# Altium project Digital_Input_Card_V1_1.PrjPcb
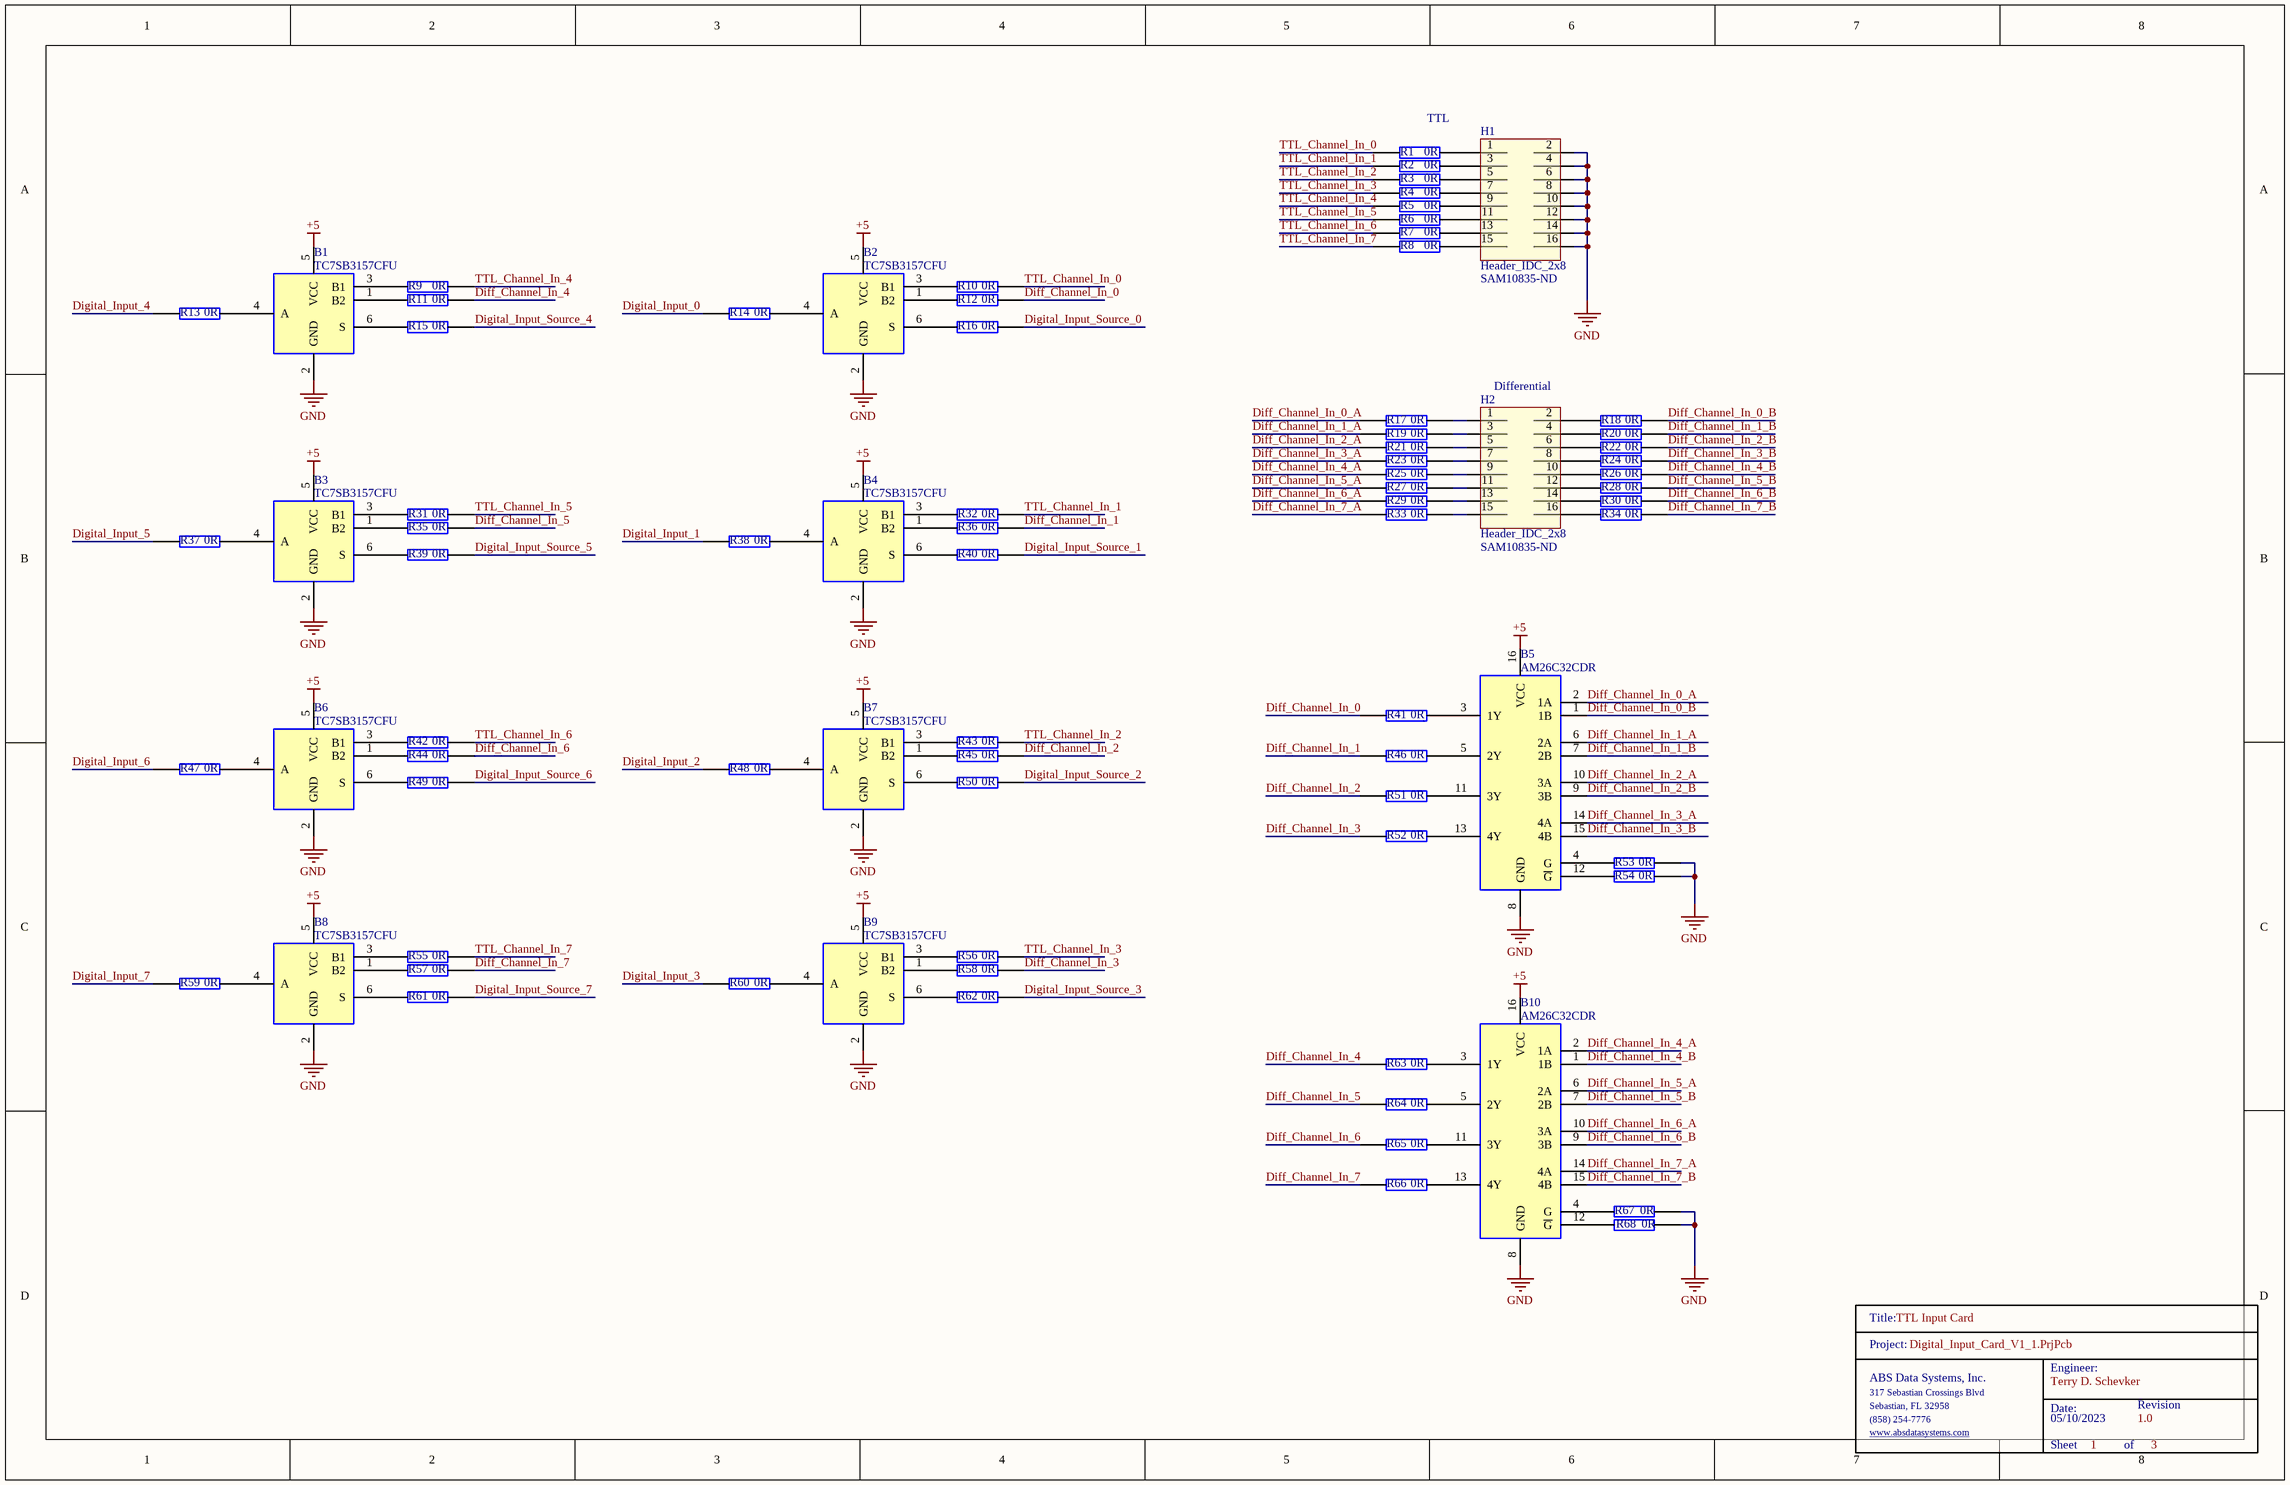
[diagram p0: Digital_Input.SchDoc]
3 sheets, 263 parts. Net scope: global (net labels, ports and power ports of the same name join across sheets).
Board file: Digital_Input_PCB.PcbDoc
Sheets:
  Digital_Input.SchDoc
  Digital_Input_CPU.SchDoc
  Digital_Input_LED_Monitor.SchDoc

## Sheet Digital_Input.SchDoc: TTL Input Card
size Tabloid; Date: 05/10/2023; Engineer: Terry D. Schevker; Revision: 1.0; SheetNumber: 1; SheetTotal: 3

### Parts
B1  TC7SB3157CFU  [SOT-363-6]
B2  TC7SB3157CFU  [SOT-363-6]
B3  TC7SB3157CFU  [SOT-363-6]
B4  TC7SB3157CFU  [SOT-363-6]
B5  AM26C32CDR  [SOIC127P600X175-16N]
B6  TC7SB3157CFU  [SOT-363-6]
B7  TC7SB3157CFU  [SOT-363-6]
B8  TC7SB3157CFU  [SOT-363-6]
B9  TC7SB3157CFU  [SOT-363-6]
B10  AM26C32CDR  [SOIC127P600X175-16N]
H1  Header_IDC_2x8  Supplier Part Number 1: SAM10835-ND  [HDR2X8]
H2  Header_IDC_2x8  Supplier Part Number 1: SAM10835-ND  [HDR2X8]
R1  0R  [0603]
R2  0R  [0603]
R3  0R  [0603]
R4  0R  [0603]
R5  0R  [0603]
R6  0R  [0603]
R7  0R  [0603]
R8  0R  [0603]
R9  0R  [0603]
R10  0R  [0603]
R11  0R  [0603]
R12  0R  [0603]
R13  0R  [0603]
R14  0R  [0603]
R15  0R  [0603]
R16  0R  [0603]
R17  0R  [0603]
R18  0R  [0603]
R19  0R  [0603]
R20  0R  [0603]
R21  0R  [0603]
R22  0R  [0603]
R23  0R  [0603]
R24  0R  [0603]
R25  0R  [0603]
R26  0R  [0603]
R27  0R  [0603]
R28  0R  [0603]
R29  0R  [0603]
R30  0R  [0603]
R31  0R  [0603]
R32  0R  [0603]
R33  0R  [0603]
R34  0R  [0603]
R35  0R  [0603]
R36  0R  [0603]
R37  0R  [0603]
R38  0R  [0603]
R39  0R  [0603]
R40  0R  [0603]
R41  0R  [0603]
R42  0R  [0603]
R43  0R  [0603]
R44  0R  [0603]
R45  0R  [0603]
R46  0R  [0603]
R47  0R  [0603]
R48  0R  [0603]
R49  0R  [0603]
R50  0R  [0603]
R51  0R  [0603]
R52  0R  [0603]
R53  0R  [0603]
R54  0R  [0603]
R55  0R  [0603]
R56  0R  [0603]
R57  0R  [0603]
R58  0R  [0603]
R59  0R  [0603]
R60  0R  [0603]
R61  0R  [0603]
R62  0R  [0603]
R63  0R  [0603]
R64  0R  [0603]
R65  0R  [0603]
R66  0R  [0603]
R67  0R  [0603]
R68  0R  [0603]
TitleBlock_4  TitleBlock  (value not drawn)  (graphical)

### Nets
+5: B1.5(VCC) B2.5(VCC) B3.5(VCC) B4.5(VCC) B5.16(VCC) B6.5(VCC) B7.5(VCC) B8.5(VCC) B9.5(VCC) B10.16(VCC)
GND: B1.2(GND) B2.2(GND) B3.2(GND) B4.2(GND) B5.8(GND) B6.2(GND) B7.2(GND) B8.2(GND) B9.2(GND) B10.8(GND) H1.2 H1.4 H1.6 H1.8 H1.10 H1.12 H1.14 H1.16 R53.2 R54.2 R67.2 R68.2
Diff_Channel_In_0: R12.2 R41.1
Diff_Channel_In_0_A: B5.2(1A) R17.1
Diff_Channel_In_0_B: B5.1(1B) R18.2
Diff_Channel_In_1: R36.2 R46.1
Diff_Channel_In_1_A: B5.6(2A) R19.1
Diff_Channel_In_1_B: B5.7(2B) R20.2
Diff_Channel_In_2: R45.2 R51.1
Diff_Channel_In_2_A: B5.10(3A) R21.1
Diff_Channel_In_2_B: B5.9(3B) R22.2
Diff_Channel_In_3: R52.1 R58.2
Diff_Channel_In_3_A: B5.14(4A) R23.1
Diff_Channel_In_3_B: B5.15(4B) R24.2
Diff_Channel_In_4: R11.2 R63.1
Diff_Channel_In_4_A: B10.2(1A) R25.1
Diff_Channel_In_4_B: B10.1(1B) R26.2
Diff_Channel_In_5: R35.2 R64.1
Diff_Channel_In_5_A: B10.6(2A) R27.1
Diff_Channel_In_5_B: B10.7(2B) R28.2
Diff_Channel_In_6: R44.2 R65.1
Diff_Channel_In_6_A: B10.10(3A) R29.1
Diff_Channel_In_6_B: B10.9(3B) R30.2
Diff_Channel_In_7: R57.2 R66.1
Diff_Channel_In_7_A: B10.14(4A) R33.1
Diff_Channel_In_7_B: B10.15(4B) R34.2
Digital_Input_0: R14.1
Digital_Input_1: R38.1
Digital_Input_2: R48.1
Digital_Input_3: R60.1
Digital_Input_4: R13.1
Digital_Input_5: R37.1
Digital_Input_6: R47.1
Digital_Input_7: R59.1
Digital_Input_Source_0: R16.2
Digital_Input_Source_1: R40.2
Digital_Input_Source_2: R50.2
Digital_Input_Source_3: R62.2
Digital_Input_Source_4: R15.2
Digital_Input_Source_5: R39.2
Digital_Input_Source_6: R49.2
Digital_Input_Source_7: R61.2
TTL_Channel_In_0: R1.1 R10.2
TTL_Channel_In_1: R2.1 R32.2
TTL_Channel_In_2: R3.1 R43.2
TTL_Channel_In_3: R4.1 R56.2
TTL_Channel_In_4: R5.1 R9.2
TTL_Channel_In_5: R6.1 R31.2
TTL_Channel_In_6: R7.1 R42.2
TTL_Channel_In_7: R8.1 R55.2
NetB1_1: B1.1(B2) R11.1
NetB1_3: B1.3(B1) R9.1
NetB1_4: B1.4(A) R13.2
NetB1_6: B1.6(S) R15.1
NetB2_1: B2.1(B2) R12.1
NetB2_3: B2.3(B1) R10.1
NetB2_4: B2.4(A) R14.2
NetB2_6: B2.6(S) R16.1
NetB3_1: B3.1(B2) R35.1
NetB3_3: B3.3(B1) R31.1
NetB3_4: B3.4(A) R37.2
NetB3_6: B3.6(S) R39.1
NetB4_1: B4.1(B2) R36.1
NetB4_3: B4.3(B1) R32.1
NetB4_4: B4.4(A) R38.2
NetB4_6: B4.6(S) R40.1
NetB5_3: B5.3(1Y) R41.2
NetB5_4: B5.4(G) R53.1
NetB5_5: B5.5(2Y) R46.2
NetB5_11: B5.11(3Y) R51.2
NetB5_12: B5.12(~{G}) R54.1
NetB5_13: B5.13(4Y) R52.2
NetB6_1: B6.1(B2) R44.1
NetB6_3: B6.3(B1) R42.1
NetB6_4: B6.4(A) R47.2
NetB6_6: B6.6(S) R49.1
NetB7_1: B7.1(B2) R45.1
NetB7_3: B7.3(B1) R43.1
NetB7_4: B7.4(A) R48.2
NetB7_6: B7.6(S) R50.1
NetB8_1: B8.1(B2) R57.1
NetB8_3: B8.3(B1) R55.1
NetB8_4: B8.4(A) R59.2
NetB8_6: B8.6(S) R61.1
NetB9_1: B9.1(B2) R58.1
NetB9_3: B9.3(B1) R56.1
NetB9_4: B9.4(A) R60.2
NetB9_6: B9.6(S) R62.1
NetB10_3: B10.3(1Y) R63.2
NetB10_4: B10.4(G) R67.1
NetB10_5: B10.5(2Y) R64.2
NetB10_11: B10.11(3Y) R65.2
NetB10_12: B10.12(~{G}) R68.1
NetB10_13: B10.13(4Y) R66.2
NetH1_1: H1.1 R1.2
NetH1_3: H1.3 R2.2
NetH1_5: H1.5 R3.2
NetH1_7: H1.7 R4.2
NetH1_9: H1.9 R5.2
NetH1_11: H1.11 R6.2
NetH1_13: H1.13 R7.2
NetH1_15: H1.15 R8.2
NetH2_1: H2.1 R17.2
NetH2_2: H2.2 R18.1
NetH2_3: H2.3 R19.2
NetH2_4: H2.4 R20.1
NetH2_5: H2.5 R21.2
NetH2_6: H2.6 R22.1
NetH2_7: H2.7 R23.2
NetH2_8: H2.8 R24.1
NetH2_9: H2.9 R25.2
NetH2_10: H2.10 R26.1
NetH2_11: H2.11 R27.2
NetH2_12: H2.12 R28.1
NetH2_13: H2.13 R29.2
NetH2_14: H2.14 R30.1
NetH2_15: H2.15 R33.2
NetH2_16: H2.16 R34.1

### Notes on the sheet
- TTL
- Differential
- (in symbol TitleBlock) Title:; Project:; Engineer:; ABS Data Systems, Inc.; 317 Sebastian Crossings Blvd; Sebastian, FL 32958; Date:; Revision; (858) 254-7776; www.absdatasystems.com; Sheet; of

### Library data of the parts
B1-B4 B6-B9 = TC7SB3157CFU: TC7SB3157CFU MUX 2 in 1 out with control bit; Manufacturer_Name: Nexperia; Manufacturer_Part_Number: PMP3906AYSH; Geometry.Height: 1.1mm; Mouser Part Number: 771-PMP3906AYSH; Mouser Price/Stock: https://www.mouser.co.uk/ProductDetail/Nexperia/PMP3906AYSH?qs=vvQtp7zwQdPhl6IciBiaKA%3D%3D; Datasheet Link: https://assets.nexperia.com/documents/data-sheet/PMP3906AYS.pdf
B5 B10 = AM26C32CDR: TEXAS INSTRUMENTS - AM26C32CDR - Receiver RS422/423, 4 Drivers, 4.5V-5.5V supply, SOIC-16; Geometry.Height: 1.75mm; Mouser Part Number: 595-AM26C32CDR; Mouser Price/Stock: https://www.mouser.co.uk/ProductDetail/Texas-Instruments/AM26C32CDR?qs=LgZHeZZt5MVmFjCK4imaTA%3D%3D; Manufacturer_Name: Texas Instruments; Manufacturer_Part_Number: AM26C32CDR; Datasheet Link: https://www.ti.com/lit/ds/symlink/am26c32.pdf?ts=1601403310434&ref_url=https%253A%252F%252Fwww.ti.com%252Fproduct%252FAM26C32
H1 H2 = Header_IDC_2x8: 16 Pin 2x8 Through Hold IDC Connector; Manufacturer: Samtec; Manufacturer Part Number: TST-108-01-G-D; Number of Contacts: 16; Gender: Male; Connector Type: Male Pin; Pitch: 2.54mm; Row Spacing: 0.1inch; Supplier 1: Digi-Key; RoHS: Yes; Category: Headers and Wire Housings; Stock 1: 227; Pricing 1: 1=2.85000, 10=2.73600, 100=2.28000, 500=1.93800, 1000=1.65300, 5000=1.48200 (USD); Mount: Through Hole; Contact Plating: Gold; Contact Material: Bronze; Housing Material: Polyester; Housing Color: Black; Color: Black; Min Operating Temperature: -55°C; Max Operating Temperature: 125°C; Number of Rows: 2; Termination: Solder; Packaging: Rail/Tube; Orientation: Straight; Number of Positions: 16; Length: 27.94mm; Depth: 9.27mm; Contact Mating Length: 0.25inch; REACH SVHC: No SVHC; ComponentLink1URL: https://datasheet.ciiva.com/739/tst-mkt-739845.pdf?src-supplier=Digi-Key; ComponentLink1Description: https://datasheet.ciiva.com/739/tst-mkt-739845.pdf?src-supplier=Digi-Key; ComponentLink2URL: https://datasheet.ciiva.com/10018/htst-10018510.pdf?src-supplier=Avnet; ComponentLink2Description: https://datasheet.ciiva.com/10018/htst-10018510.pdf?src-supplier=Avnet
R1-R68 = RC0603JR-070RL: YAGEO 0603 0 ohm; Manufacturer_Name: KEMET; Geometry.Height: 0.55mm; Mouser Part Number: 603-RC0603JR-070RL; Mouser Price/Stock: https://www.mouser.co.uk/ProductDetail/YAGEO/RC0603JR-070RL?qs=2cAdsCoAWRGWyPcuXgGiXQ%3D%3D; Manufacturer_Part_Number: RC0603JR-070RL; Datasheet Link: https://datasheet.datasheetarchive.com/originals/distributors/Datasheets_SAMA/902f9e387b938f871d31120f5fc1d65e.pdf

## Sheet Digital_Input_CPU.SchDoc: TTL IO Interface for External I/O
size Tabloid; Date: 03/13/2023; Engineer: Terry D. Schevker; Revision: 1,0; SheetNumber: 2; SheetTotal: 3
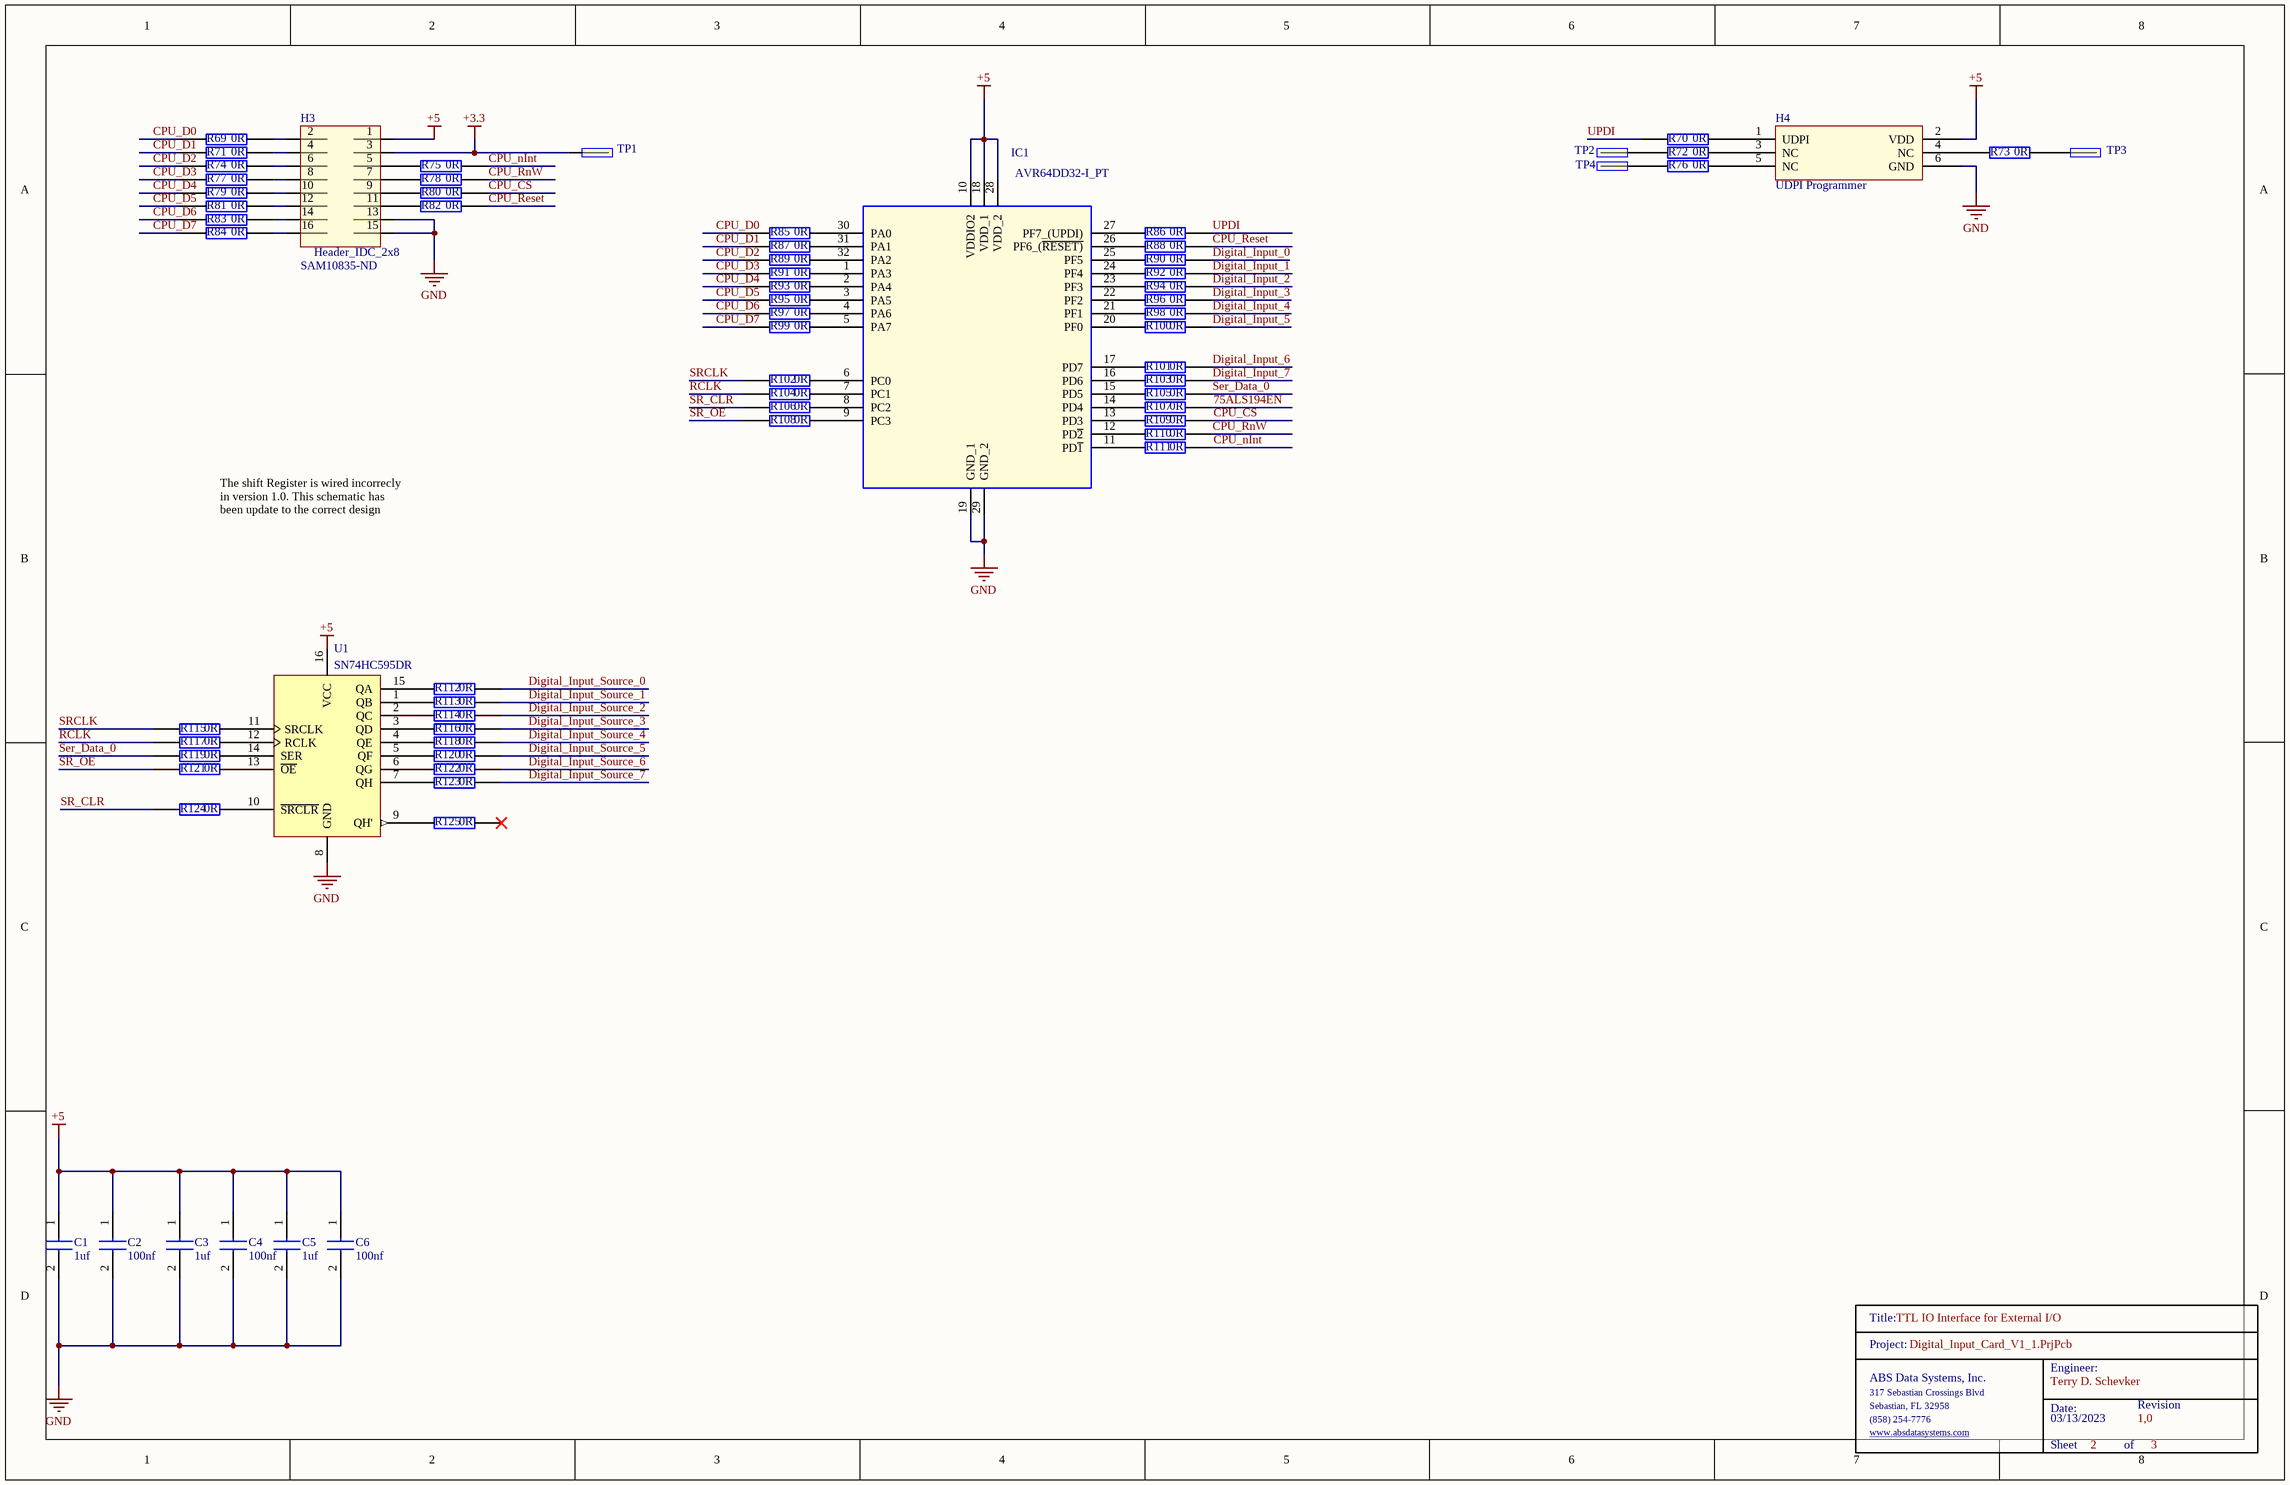
[diagram p1: Digital_Input_CPU.SchDoc]

### Parts
C1  1uf  [0603]
C2  100nf  [0603]
C3  1uf  [0603]
C4  100nf  [0603]
C5  1uf  [0603]
C6  100nf  [0603]
H3  Header_IDC_2x8  Supplier Part Number 1: SAM10835-ND  [HEADER16]
H4  UDPI Programmer  [HDR2X3]
IC1  AVR64DD32-I_PT  [QFP80P900X900X120-32N]
R69  0R  [0603]
R70  0R  [0603]
R71  0R  [0603]
R72  0R  [0603]
R73  0R  [0603]
R74  0R  [0603]
R75  0R  [0603]
R76  0R  [0603]
R77  0R  [0603]
R78  0R  [0603]
R79  0R  [0603]
R80  0R  [0603]
R81  0R  [0603]
R82  0R  [0603]
R83  0R  [0603]
R84  0R  [0603]
R85  0R  [0603]
R86  0R  [0603]
R87  0R  [0603]
R88  0R  [0603]
R89  0R  [0603]
R90  0R  [0603]
R91  0R  [0603]
R92  0R  [0603]
R93  0R  [0603]
R94  0R  [0603]
R95  0R  [0603]
R96  0R  [0603]
R97  0R  [0603]
R98  0R  [0603]
R99  0R  [0603]
R100  0R  [0603]
R101  0R  [0603]
R102  0R  [0603]
R103  0R  [0603]
R104  0R  [0603]
R105  0R  [0603]
R106  0R  [0603]
R107  0R  [0603]
R108  0R  [0603]
R109  0R  [0603]
R110  0R  [0603]
R111  0R  [0603]
R112  0R  [0603]
R113  0R  [0603]
R114  0R  [0603]
R115  0R  [0603]
R116  0R  [0603]
R117  0R  [0603]
R118  0R  [0603]
R119  0R  [0603]
R120  0R  [0603]
R121  0R  [0603]
R122  0R  [0603]
R123  0R  [0603]
R124  0R  [0603]
R125  0R  [0603]
TitleBlock_1  TitleBlock  (value not drawn)  (graphical)
TP1  TP  [TP]  (value not drawn)
TP2  TP  [TP]  (value not drawn)
TP3  TP  [TP]  (value not drawn)
TP4  TP  [TP]  (value not drawn)
U1  SN74HC595DR  [SOIC_16_Narrow]

### Nets
+3.3: H3.3 TP1.1
+5: C1.1 C2.1 C3.1 C4.1 C5.1 C6.1 H3.1 H4.2(VDD) IC1.10(VDDIO2) IC1.18(VDD_1) IC1.28(VDD_2) U1.16(VCC)
GND: C1.2 C2.2 C3.2 C4.2 C5.2 C6.2 H3.13 H3.15 H4.6(GND) IC1.19(GND_1) IC1.29(GND_2) U1.8(GND)
75ALS194EN: R107.2
CPU_CS: R80.2 R109.2
CPU_D0: R69.1 R85.1
CPU_D1: R71.1 R87.1
CPU_D2: R74.1 R89.1
CPU_D3: R77.1 R91.1
CPU_D4: R79.1 R93.1
CPU_D5: R81.1 R95.1
CPU_D6: R83.1 R97.1
CPU_D7: R84.1 R99.1
CPU_nInt: R75.2 R111.2
CPU_Reset: R82.2 R88.2
CPU_RnW: R78.2 R110.2
Digital_Input_0: R90.2
Digital_Input_1: R92.2
Digital_Input_2: R94.2
Digital_Input_3: R96.2
Digital_Input_4: R98.2
Digital_Input_5: R100.2
Digital_Input_6: R101.2
Digital_Input_7: R103.2
Digital_Input_Source_0: R112.2
Digital_Input_Source_1: R113.2
Digital_Input_Source_2: R114.2
Digital_Input_Source_3: R116.2
Digital_Input_Source_4: R118.2
Digital_Input_Source_5: R120.2
Digital_Input_Source_6: R122.2
Digital_Input_Source_7: R123.2
RCLK: R104.1 R117.1
Ser_Data_0: R105.2 R119.1
SR_CLR: R106.1 R124.1
SR_OE: R108.1 R121.1
SRCLK: R102.1 R115.1
UPDI: R70.1 R86.2
NetH3_2: H3.2 R69.2
NetH3_4: H3.4 R71.2
NetH3_5: H3.5 R75.1
NetH3_6: H3.6 R74.2
NetH3_7: H3.7 R78.1
NetH3_8: H3.8 R77.2
NetH3_9: H3.9 R80.1
NetH3_10: H3.10 R79.2
NetH3_11: H3.11 R82.1
NetH3_12: H3.12 R81.2
NetH3_14: H3.14 R83.2
NetH3_16: H3.16 R84.2
NetH4_1: H4.1(UDPI) R70.2
NetH4_3: H4.3(NC) R72.2
NetH4_4: H4.4(NC) R73.1
NetH4_5: H4.5(NC) R76.2
NetIC1_1: IC1.1(PA3) R91.2
NetIC1_2: IC1.2(PA4) R93.2
NetIC1_3: IC1.3(PA5) R95.2
NetIC1_4: IC1.4(PA6) R97.2
NetIC1_5: IC1.5(PA7) R99.2
NetIC1_6: IC1.6(PC0) R102.2
NetIC1_7: IC1.7(PC1) R104.2
NetIC1_8: IC1.8(PC2) R106.2
NetIC1_9: IC1.9(PC3) R108.2
NetIC1_11: IC1.11(PD~{1}) R111.1
NetIC1_12: IC1.12(PD~{2}) R110.1
NetIC1_13: IC1.13(PD3) R109.1
NetIC1_14: IC1.14(PD4) R107.1
NetIC1_15: IC1.15(PD5) R105.1
NetIC1_16: IC1.16(PD6) R103.1
NetIC1_17: IC1.17(PD7) R101.1
NetIC1_20: IC1.20(PF0) R100.1
NetIC1_21: IC1.21(PF1) R98.1
NetIC1_22: IC1.22(PF2) R96.1
NetIC1_23: IC1.23(PF3) R94.1
NetIC1_24: IC1.24(PF4) R92.1
NetIC1_25: IC1.25(PF5) R90.1
NetIC1_26: IC1.26(PF6_(~{RESET)}) R88.1
NetIC1_27: IC1.27(PF7_(UPDI)) R86.1
NetIC1_30: IC1.30(PA0) R85.2
NetIC1_31: IC1.31(PA1) R87.2
NetIC1_32: IC1.32(PA2) R89.2
NetR72_1: R72.1 TP2.1
NetR73_2: R73.2 TP3.1
NetR76_1: R76.1 TP4.1
NetR112_1: R112.1 U1.15(QA)
NetR113_1: R113.1 U1.1(QB)
NetR114_1: R114.1 U1.2(QC)
NetR115_2: R115.2 U1.11(SRCLK)
NetR116_1: R116.1 U1.3(QD)
NetR117_2: R117.2 U1.12(RCLK)
NetR118_1: R118.1 U1.4(QE)
NetR119_2: R119.2 U1.14(SER)
NetR120_1: R120.1 U1.5(QF)
NetR121_2: R121.2 U1.13(~{OE})
NetR122_1: R122.1 U1.6(QG)
NetR123_1: R123.1 U1.7(QH)
NetR124_2: R124.2 U1.10(~{SRCLR})
NetR125_1: R125.1 U1.9(QH')

Not connected (* = marked no-connect by the designer): R125 2*

### Notes on the sheet
- The shift Register is wired incorrecly in version 1.0. This schematic has been update to the correct design
- (in symbol TitleBlock) Title:; Project:; Engineer:; ABS Data Systems, Inc.; 317 Sebastian Crossings Blvd; Sebastian, FL 32958; Date:; Revision; (858) 254-7776; www.absdatasystems.com; Sheet; of

### Library data of the parts
C1 C3 C5 = CL10B105KA8NNNL: Samsung Electro-Mechanics 0603 1uf
C2 C4 C6 = CL10B104JB8NNNC: Samsung Electro-Mechanics 0603 100nf
H3 = Header_IDC_2x8: as H1 on sheet Digital_Input; Supplier 1: Digi-Key; RoHS: Yes; Category: Headers and Wire Housings; Stock 1: 227; Pricing 1: 1=2.85000, 10=2.73600, 100=2.28000, 500=1.93800, 1000=1.65300, 5000=1.48200 (USD); Mount: Through Hole; Contact Plating: Gold; Contact Material: Bronze; Housing Material: Polyester; Housing Color: Black; Color: Black; Min Operating Temperature: -55°C; Max Operating Temperature: 125°C; Number of Rows: 2; Termination: Solder; Packaging: Rail/Tube; Orientation: Straight; Number of Positions: 16; Length: 27.94mm; Depth: 9.27mm; Contact Mating Length: 0.25inch; REACH SVHC: No SVHC; ComponentLink1URL: https://datasheet.ciiva.com/739/tst-mkt-739845.pdf?src-supplier=Digi-Key; ComponentLink1Description: https://datasheet.ciiva.com/739/tst-mkt-739845.pdf?src-supplier=Digi-Key; ComponentLink2URL: https://datasheet.ciiva.com/10018/htst-10018510.pdf?src-supplier=Avnet; ComponentLink2Description: https://datasheet.ciiva.com/10018/htst-10018510.pdf?src-supplier=Avnet
H4 = UDPI Programmer: 6 Pin 2X3 Through Hole Header
IC1 = AVR64DD32-I_PT: Integrated Circuit; Manufacturer_Name: Microchip; Manufacturer_Part_Number: AVR64DD32-I/PT | MULTI-VOLTAGE I/O; Datasheet Link: https://www.microchip.com/en-us/product/AVR64DD32; Height: 1.2mm
R69-R125 = RC0603JR-070RL: as R1 on sheet Digital_Input; Mouser Part Number: 603-RC0603JR-070RL; Mouser Price/Stock: https://www.mouser.co.uk/ProductDetail/YAGEO/RC0603JR-070RL?qs=2cAdsCoAWRGWyPcuXgGiXQ%3D%3D; Manufacturer_Part_Number: RC0603JR-070RL; Datasheet Link: https://datasheet.datasheetarchive.com/originals/distributors/Datasheets_SAMA/902f9e387b938f871d31120f5fc1d65e.pdf
TP1-TP4 = TP: Manufacturer: Samtec; Manufacturer Part Number: TST-105-01-G-D; Number of Contacts: 16; Gender: Male; Connector Type: Male Pin; Pitch: 2.54mm; Row Spacing: 0.1inch; Supplier 1: Digi-Key; RoHS: Yes; Category: Headers and Wire Housings; Stock 1: 227; Pricing 1: 1=2.85000, 10=2.73600, 100=2.28000, 500=1.93800, 1000=1.65300, 5000=1.48200 (USD); Mount: Through Hole; Contact Plating: Gold; Contact Material: Bronze; Housing Material: Polyester; Housing Color: Black; Color: Black; Min Operating Temperature: -55°C; Max Operating Temperature: 125°C; Number of Rows: 2; Termination: Solder; Packaging: Rail/Tube; Orientation: Straight; Number of Positions: 16; Length: 27.94mm; Depth: 9.27mm; Contact Mating Length: 0.25inch; REACH SVHC: No SVHC; ComponentLink1URL: https://datasheet.ciiva.com/739/tst-mkt-739845.pdf?src-supplier=Digi-Key; ComponentLink1Description: https://datasheet.ciiva.com/739/tst-mkt-739845.pdf?src-supplier=Digi-Key; ComponentLink2URL: https://datasheet.ciiva.com/10018/htst-10018510.pdf?src-supplier=Avnet; ComponentLink2Description: https://datasheet.ciiva.com/10018/htst-10018510.pdf?src-supplier=Avnet
U1 = SN74HC595DR: 8-Bit Shift Registers With 3-State Output Registers, D0016A, LARGE T&R; Manufacturer: Texas Instruments; Output Drive (IOL/IOH)(Max)(mA): 7.8/-7.8; Rating: Military; ICC @ Nom Voltage(Max)(mA): 0.08; VCC(Min)(V): 2; tpd @ Nom Voltage(Max)(ns): 34; 3-State Output: Yes; Output Type: CMOS; Voltage(Nom)(V): 6; F @ Nom Voltage(Max)(Mhz): 28; Technology Family: HC; Bits: 4; Max Supply Voltage: 6V; Min Supply Voltage: 2V; Propagation Delay: 250ns; Number of Elements: 1; Number of Output Lines: 10; Direction: Unidirectional; Number of Bits: 8; Quiescent Current: 8uA; Operating Supply Voltage: 5V; Frequency: 42MHz; Max Input Current: 1uA; PackageReference: D0016A; Code_JEDEC: MS-012 variation AC; Generic Part Number: SN74HC595; Operating Temperature Range(C): -40 to 85; DatasheetVersion: SCLS041H; PackageVersion: http://www.ti.com/lit/ml/mpds178g/mpds178g.pdf; Input Type: CMOS; VCC(Max)(V): 6; Supplier 1: Digi-Key; Supplier Part Number 1: 296-14857-1-ND; Manufacturer Part Number: SN74HC595DR; Stock 1: 38406; Pricing 1: 1=0.51000, 10=0.43300, 100=0.32300, 500=0.25380, 1000=0.19611 (USD); RoHS: Yes; Mount: Surface Mount; Case/Package: SOIC; Number of Pins: 16; Weight: 0.004998oz; Contact Plating: Gold; Min Operating Temperature: -40°C; Max Operating Temperature: 85°C; Packaging: Tape and Reel; Package Quantity: 2500; Logic Function: Shift Register; Number of Circuits: 4; Number of Bits per Element: 8; Turn-On Delay Time: 250ns; Termination: SMD/SMT; Length: 9.9mm; Height: 1.58mm; Width: 3.91mm; Radiation Hardening: No; REACH SVHC: No SVHC; Lead Free: Lead Free; ComponentLink1URL: https://datasheet.ciiva.com/15093/getdatasheetpartid-134875-15093436.pdf?src-supplier=Verical; ComponentLink1Description: https://datasheet.ciiva.com/15093/getdatasheetpartid-134875-15093436.pdf?src-supplier=Verical; ComponentLink2URL: https://datasheet.ciiva.com/22696/1831198-22696812.pdf?src-supplier=Element14; ComponentLink2Description: https://datasheet.ciiva.com/22696/1831198-22696812.pdf?src-supplier=Element14; ComponentLink3URL: https://datasheet.ciiva.com/34301/916385-34301758.pdf?src-supplier=Jameco; ComponentLink3Description: https://datasheet.ciiva.com/34301/916385-34301758.pdf?src-supplier=Jameco; ComponentLink4URL: https://datasheet.ciiva.com/26866/sn74hc595dr-26866161.pdf?src-supplier=IIIC; ComponentLink4Description: https://datasheet.ciiva.com/26866/sn74hc595dr-26866161.pdf?src-supplier=IIIC; ComponentLink5URL: https://datasheet.ciiva.com/1886/sn74hc595-1886279.pdf?src-supplier=Digi-Key; ComponentLink5Description: https://datasheet.ciiva.com/1886/sn74hc595-1886279.pdf?src-supplier=Digi-Key; ComponentLink6URL: https://datasheet.ciiva.com/1886/sn74hc595-1886280.pdf?src-supplier=Digi-Key; ComponentLink6Description: https://datasheet.ciiva.com/1886/sn74hc595-1886280.pdf?src-supplier=Digi-Key; ComponentLink7URL: https://datasheet.ciiva.com/1886/sn74hc595-1886281.pdf?src-supplier=Digi-Key; ComponentLink7Description: https://datasheet.ciiva.com/1886/sn74hc595-1886281.pdf?src-supplier=Digi-Key; ComponentLink8URL: https://datasheet.ciiva.com/1509/1831198-1509483.pdf?src-supplier=Element14; ComponentLink8Description: https://datasheet.ciiva.com/1509/1831198-1509483.pdf?src-supplier=Element14; ComponentLink9URL: https://datasheet.ciiva.com/46381/1886142-46381835.pdf?src-supplier=Element14; ComponentLink9Description: https://datasheet.ciiva.com/46381/1886142-46381835.pdf?src-supplier=Element14; ComponentLink10URL: https://datasheet.ciiva.com/14294/sn74hc595-14294989.pdf?src-supplier=Avnet; ComponentLink10Description: https://datasheet.ciiva.com/14294/sn74hc595-14294989.pdf?src-supplier=Avnet; ComponentLink11URL: https://datasheet.ciiva.com/14294/sn74hc595-14294991.pdf?src-supplier=Avnet; ComponentLink11Description: https://datasheet.ciiva.com/14294/sn74hc595-14294991.pdf?src-supplier=Avnet; ComponentLink12URL: https://datasheet.ciiva.com/46435/1831198-46435871.pdf?src-supplier=Element14; ComponentLink12Description: https://datasheet.ciiva.com/46435/1831198-46435871.pdf?src-supplier=Element14

## Sheet Digital_Input_LED_Monitor.SchDoc: TTL IO LED Monitor
size Tabloid; Date: 05/10/2023; Engineer: Terry D. Schevker; Revision: 1.0; SheetNumber: 3; SheetTotal: 3
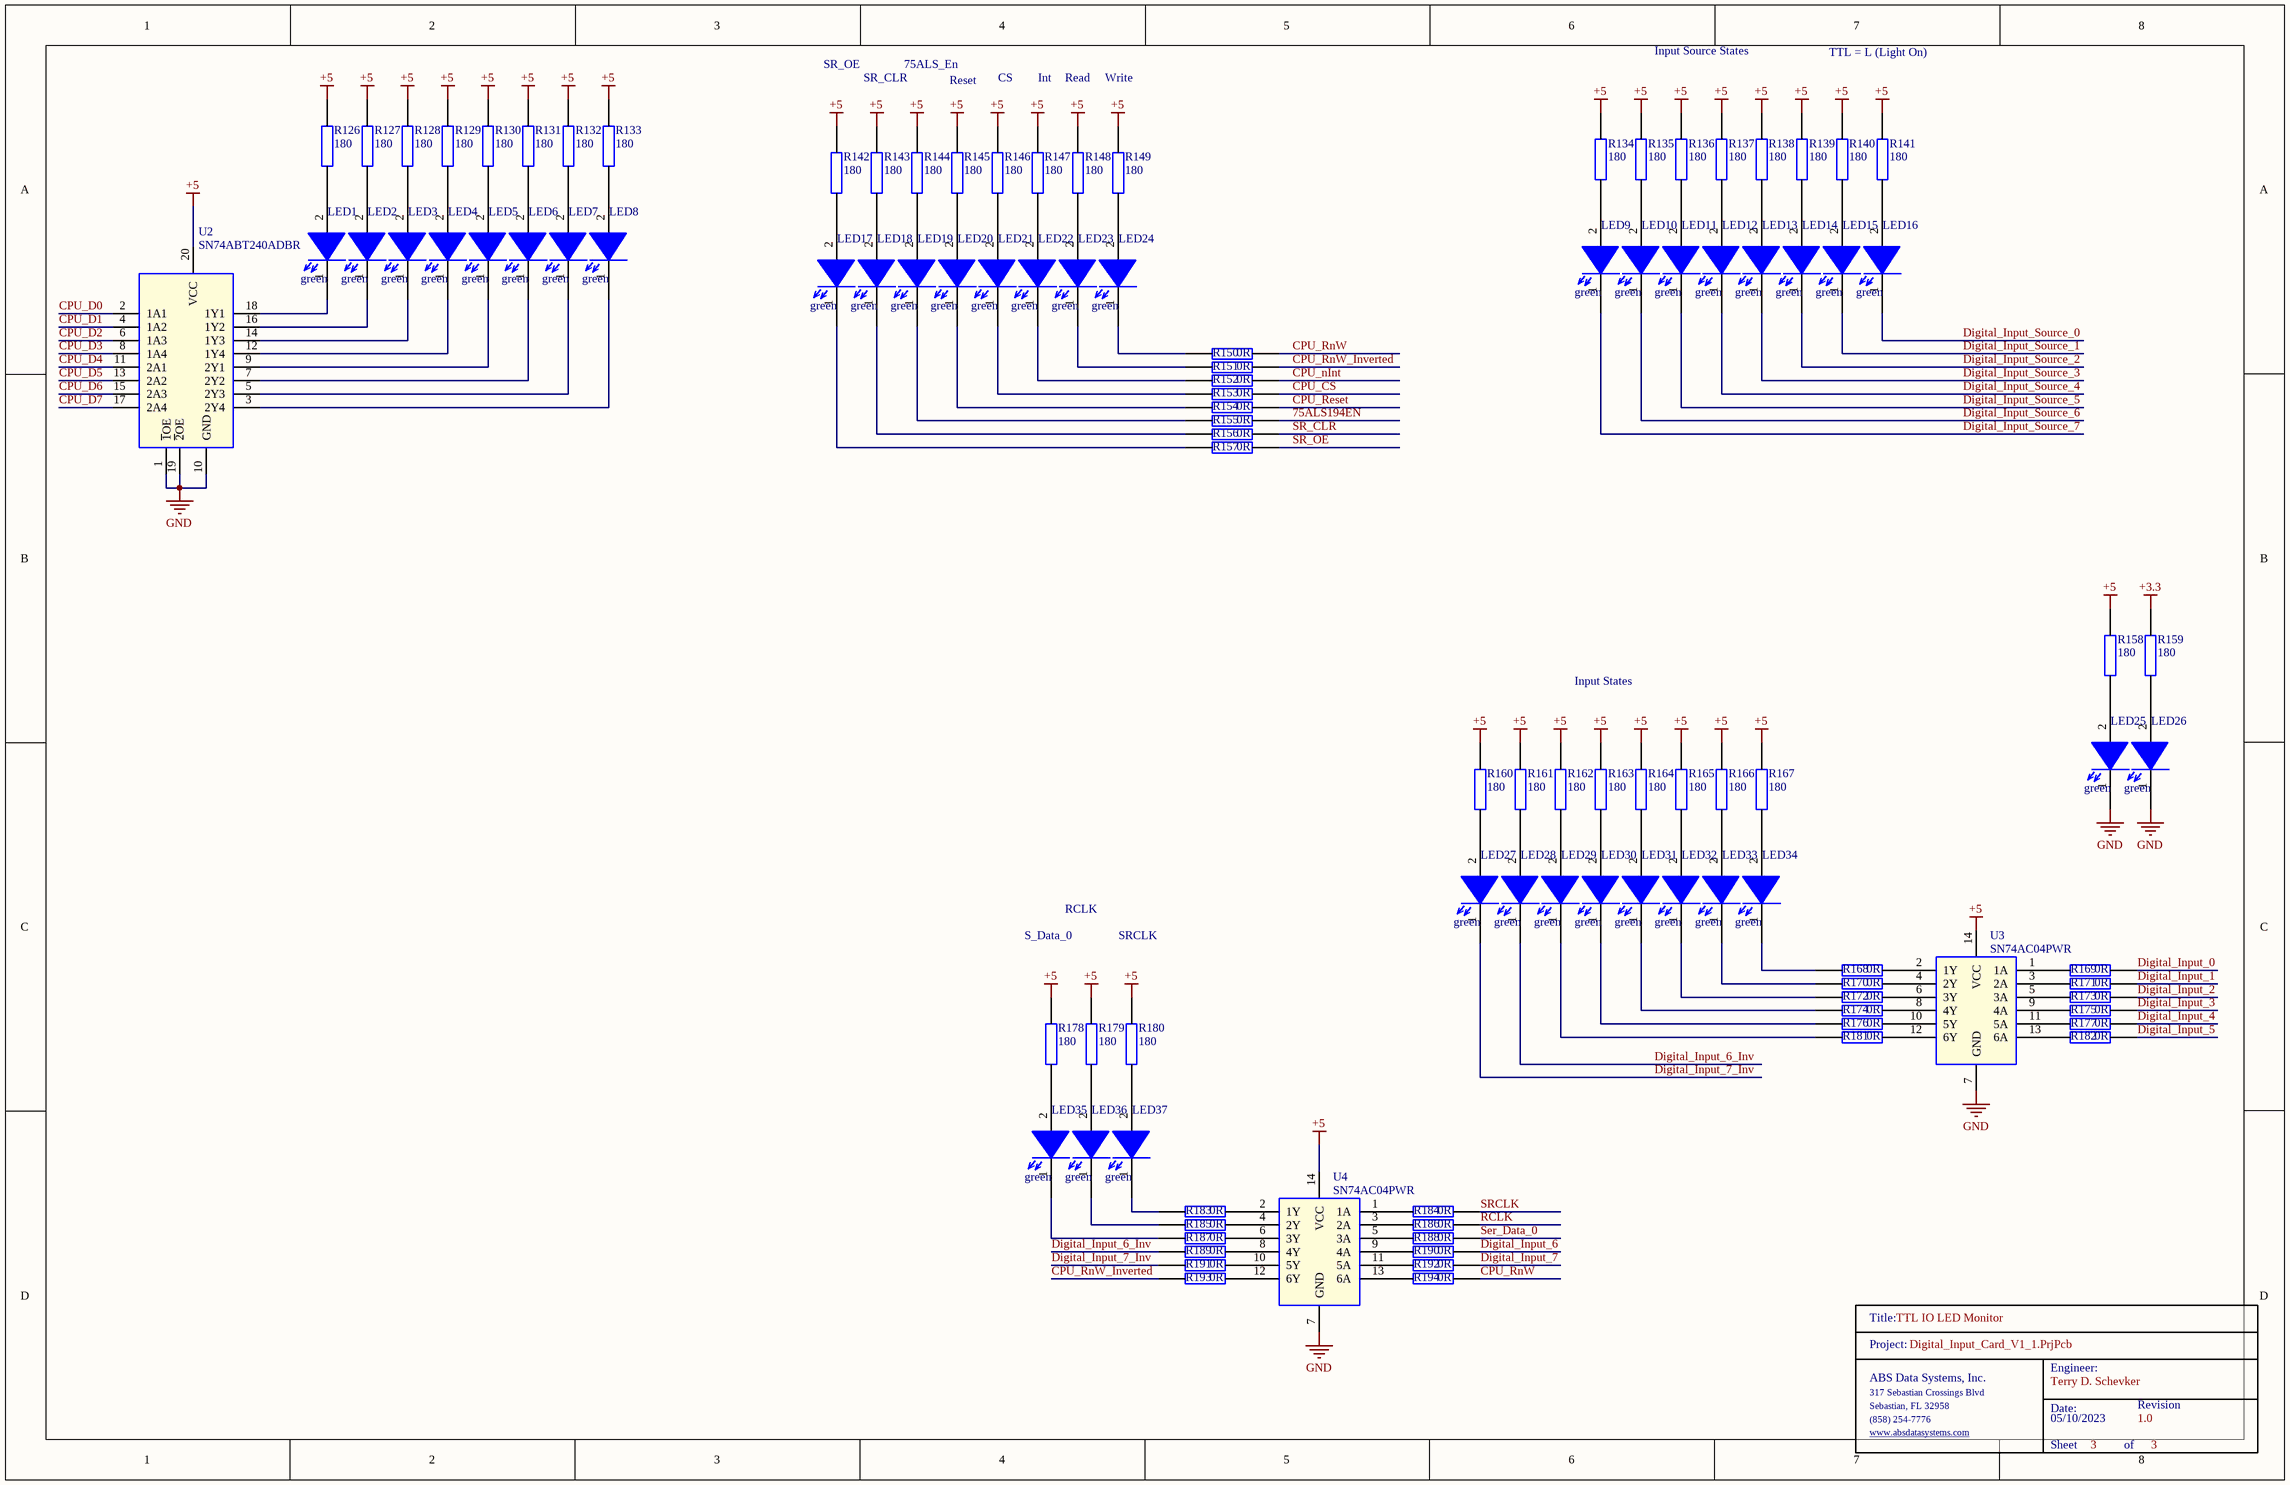
[diagram p2: Digital_Input_LED_Monitor.SchDoc]

### Parts
LED1  green  [0603_Diode]
LED2  green  [0603_Diode]
LED3  green  [0603_Diode]
LED4  green  [0603_Diode]
LED5  green  [0603_Diode]
LED6  green  [0603_Diode]
LED7  green  [0603_Diode]
LED8  green  [0603_Diode]
LED9  green  [0603_Diode]
LED10  green  [0603_Diode]
LED11  green  [0603_Diode]
LED12  green  [0603_Diode]
LED13  green  [0603_Diode]
LED14  green  [0603_Diode]
LED15  green  [0603_Diode]
LED16  green  [0603_Diode]
LED17  green  [0603_Diode]
LED18  green  [0603_Diode]
LED19  green  [0603_Diode]
LED20  green  [0603_Diode]
LED21  green  [0603_Diode]
LED22  green  [0603_Diode]
LED23  green  [0603_Diode]
LED24  green  [0603_Diode]
LED25  green  [0603_Diode]
LED26  green  [0603_Diode]
LED27  green  [0603_Diode]
LED28  green  [0603_Diode]
LED29  green  [0603_Diode]
LED30  green  [0603_Diode]
LED31  green  [0603_Diode]
LED32  green  [0603_Diode]
LED33  green  [0603_Diode]
LED34  green  [0603_Diode]
LED35  green  [0603_Diode]
LED36  green  [0603_Diode]
LED37  green  [0603_Diode]
R126  180  [0603]
R127  180  [0603]
R128  180  [0603]
R129  180  [0603]
R130  180  [0603]
R131  180  [0603]
R132  180  [0603]
R133  180  [0603]
R134  180  [0603]
R135  180  [0603]
R136  180  [0603]
R137  180  [0603]
R138  180  [0603]
R139  180  [0603]
R140  180  [0603]
R141  180  [0603]
R142  180  [0603]
R143  180  [0603]
R144  180  [0603]
R145  180  [0603]
R146  180  [0603]
R147  180  [0603]
R148  180  [0603]
R149  180  [0603]
R150  0R  [0603]
R151  0R  [0603]
R152  0R  [0603]
R153  0R  [0603]
R154  0R  [0603]
R155  0R  [0603]
R156  0R  [0603]
R157  0R  [0603]
R158  180  [0603]
R159  180  [0603]
R160  180  [0603]
R161  180  [0603]
R162  180  [0603]
R163  180  [0603]
R164  180  [0603]
R165  180  [0603]
R166  180  [0603]
R167  180  [0603]
R168  0R  [0603]
R169  0R  [0603]
R170  0R  [0603]
R171  0R  [0603]
R172  0R  [0603]
R173  0R  [0603]
R174  0R  [0603]
R175  0R  [0603]
R176  0R  [0603]
R177  0R  [0603]
R178  180  [0603]
R179  180  [0603]
R180  180  [0603]
R181  0R  [0603]
R182  0R  [0603]
R183  0R  [0603]
R184  0R  [0603]
R185  0R  [0603]
R186  0R  [0603]
R187  0R  [0603]
R188  0R  [0603]
R189  0R  [0603]
R190  0R  [0603]
R191  0R  [0603]
R192  0R  [0603]
R193  0R  [0603]
R194  0R  [0603]
TitleBlock_2  TitleBlock  (value not drawn)  (graphical)
U2  SN74ABT240ADBR  [SOP65P780X200-20N]
U3  SN74AC04PWR  [SOP65P640X120-14N]
U4  SN74AC04PWR  [SOP65P640X120-14N]

### Nets
+3.3: R159.2
+5: R126.2 R127.2 R128.2 R129.2 R130.2 R131.2 R132.2 R133.2 R134.2 R135.2 R136.2 R137.2 R138.2 R139.2 R140.2 R141.2 R142.2 R143.2 R144.2 R145.2 R146.2 R147.2 R148.2 R149.2 R158.2 R160.2 R161.2 R162.2 R163.2 R164.2 R165.2 R166.2 R167.2 R178.2 R179.2 R180.2 U2.20(VCC) U3.14(VCC) U4.14(VCC)
GND: LED25.1(K) LED26.1(K) U2.1(~{1}OE) U2.10(GND) U2.19(~{2}OE) U3.7(GND) U4.7(GND)
75ALS194EN: R155.2
CPU_CS: R153.2
CPU_D0: U2.2(1A1)
CPU_D1: U2.4(1A2)
CPU_D2: U2.6(1A3)
CPU_D3: U2.8(1A4)
CPU_D4: U2.11(2A1)
CPU_D5: U2.13(2A2)
CPU_D6: U2.15(2A3)
CPU_D7: U2.17(2A4)
CPU_nInt: R152.2
CPU_Reset: R154.2
CPU_RnW: R150.2 R194.2
CPU_RnW_Inverted: R151.2 R193.1
Digital_Input_0: R169.2
Digital_Input_1: R171.2
Digital_Input_2: R173.2
Digital_Input_3: R175.2
Digital_Input_4: R177.2
Digital_Input_5: R182.2
Digital_Input_6: R190.2
Digital_Input_6_Inv: LED28.1(K) R189.1
Digital_Input_7: R192.2
Digital_Input_7_Inv: LED27.1(K) R191.1
Digital_Input_Source_0: LED16.1(K)
Digital_Input_Source_1: LED15.1(K)
Digital_Input_Source_2: LED14.1(K)
Digital_Input_Source_3: LED13.1(K)
Digital_Input_Source_4: LED12.1(K)
Digital_Input_Source_5: LED11.1(K)
Digital_Input_Source_6: LED10.1(K)
Digital_Input_Source_7: LED9.1(K)
RCLK: R186.2
Ser_Data_0: R188.2
SR_CLR: R156.2
SR_OE: R157.2
SRCLK: R184.2
NetLED1_1: LED1.1(K) U2.18(1Y1)
NetLED1_2: LED1.2(A) R126.1
NetLED2_1: LED2.1(K) U2.16(1Y2)
NetLED2_2: LED2.2(A) R127.1
NetLED3_1: LED3.1(K) U2.14(1Y3)
NetLED3_2: LED3.2(A) R128.1
NetLED4_1: LED4.1(K) U2.12(1Y4)
NetLED4_2: LED4.2(A) R129.1
NetLED5_1: LED5.1(K) U2.9(2Y1)
NetLED5_2: LED5.2(A) R130.1
NetLED6_1: LED6.1(K) U2.7(2Y2)
NetLED6_2: LED6.2(A) R131.1
NetLED7_1: LED7.1(K) U2.5(2Y3)
NetLED7_2: LED7.2(A) R132.1
NetLED8_1: LED8.1(K) U2.3(2Y4)
NetLED8_2: LED8.2(A) R133.1
NetLED9_2: LED9.2(A) R134.1
NetLED10_2: LED10.2(A) R135.1
NetLED11_2: LED11.2(A) R136.1
NetLED12_2: LED12.2(A) R137.1
NetLED13_2: LED13.2(A) R138.1
NetLED14_2: LED14.2(A) R139.1
NetLED15_2: LED15.2(A) R140.1
NetLED16_2: LED16.2(A) R141.1
NetLED17_1: LED17.1(K) R157.1
NetLED17_2: LED17.2(A) R142.1
NetLED18_1: LED18.1(K) R156.1
NetLED18_2: LED18.2(A) R143.1
NetLED19_1: LED19.1(K) R155.1
NetLED19_2: LED19.2(A) R144.1
NetLED20_1: LED20.1(K) R154.1
NetLED20_2: LED20.2(A) R145.1
NetLED21_1: LED21.1(K) R153.1
NetLED21_2: LED21.2(A) R146.1
NetLED22_1: LED22.1(K) R152.1
NetLED22_2: LED22.2(A) R147.1
NetLED23_1: LED23.1(K) R151.1
NetLED23_2: LED23.2(A) R148.1
NetLED24_1: LED24.1(K) R150.1
NetLED24_2: LED24.2(A) R149.1
NetLED25_2: LED25.2(A) R158.1
NetLED26_2: LED26.2(A) R159.1
NetLED27_2: LED27.2(A) R160.1
NetLED28_2: LED28.2(A) R161.1
NetLED29_1: LED29.1(K) R181.1
NetLED29_2: LED29.2(A) R162.1
NetLED30_1: LED30.1(K) R176.1
NetLED30_2: LED30.2(A) R163.1
NetLED31_1: LED31.1(K) R174.1
NetLED31_2: LED31.2(A) R164.1
NetLED32_1: LED32.1(K) R172.1
NetLED32_2: LED32.2(A) R165.1
NetLED33_1: LED33.1(K) R170.1
NetLED33_2: LED33.2(A) R166.1
NetLED34_1: LED34.1(K) R168.1
NetLED34_2: LED34.2(A) R167.1
NetLED35_1: LED35.1(K) R187.1
NetLED35_2: LED35.2(A) R178.1
NetLED36_1: LED36.1(K) R185.1
NetLED36_2: LED36.2(A) R179.1
NetLED37_1: LED37.1(K) R183.1
NetLED37_2: LED37.2(A) R180.1
NetR168_2: R168.2 U3.2(1Y)
NetR169_1: R169.1 U3.1(1A)
NetR170_2: R170.2 U3.4(2Y)
NetR171_1: R171.1 U3.3(2A)
NetR172_2: R172.2 U3.6(3Y)
NetR173_1: R173.1 U3.5(3A)
NetR174_2: R174.2 U3.8(4Y)
NetR175_1: R175.1 U3.9(4A)
NetR176_2: R176.2 U3.10(5Y)
NetR177_1: R177.1 U3.11(5A)
NetR181_2: R181.2 U3.12(6Y)
NetR182_1: R182.1 U3.13(6A)
NetR183_2: R183.2 U4.2(1Y)
NetR184_1: R184.1 U4.1(1A)
NetR185_2: R185.2 U4.4(2Y)
NetR186_1: R186.1 U4.3(2A)
NetR187_2: R187.2 U4.6(3Y)
NetR188_1: R188.1 U4.5(3A)
NetR189_2: R189.2 U4.8(4Y)
NetR190_1: R190.1 U4.9(4A)
NetR191_2: R191.2 U4.10(5Y)
NetR192_1: R192.1 U4.11(5A)
NetR193_2: R193.2 U4.12(6Y)
NetR194_1: R194.1 U4.13(6A)

### Notes on the sheet
- SR_OE
- SR_CLR
- 75ALS_En
- Reset
- CS
- Int
- Read
- Write
- Input Source States
- TTL = L (Light On)
- Input States
- S_Data_0
- RCLK
- SRCLK
- (in symbol TitleBlock) Title:; Project:; Engineer:; ABS Data Systems, Inc.; 317 Sebastian Crossings Blvd; Sebastian, FL 32958; Date:; Revision; (858) 254-7776; www.absdatasystems.com; Sheet; of

### Library data of the parts
LED1-LED37 = 150060GS75000: Wurth Elektronik 0603 green; Manufacturer: Wurth Electronics; Wavelength: 520nm; Viewing Angle: 140°; Lens Style: Clear,Rectangular; Luminous Intensity: 430mcd; Forward Current: 30mA; Forward Voltage: 3.2V; Test Current: 20mA; Supplier 1: Digi-Key; Manufacturer Part Number: 150060GS75000; RoHS: Yes; Category: LEDs; Stock 1: 71509; Pricing 1: 1=0.14000, 50=0.13300, 100=0.11400, 500=0.09900 (USD); Mount: Surface Mount; Case/Package: 0603; Color: Green; Case Code (Metric): 1608; Case Code (Imperial): 0603; Min Operating Temperature: -40°C; Max Operating Temperature: 85°C; Package Quantity: 4000; Packaging: Tape and Reel; Dominant Wavelength: 520nm; Length: 1.6mm; Width: 0.8mm; Height: 0.7mm; REACH SVHC: Unknown; Lead Free: Lead Free; ComponentLink1URL: https://datasheet.ciiva.com/29562/150060gs75000-29562868.pdf?src-supplier=Digi-Key; ComponentLink1Description: https://datasheet.ciiva.com/29562/150060gs75000-29562868.pdf?src-supplier=Digi-Key; ComponentLink2URL: https://datasheet.ciiva.com/29279/759427-da-01-en-chipled-0603-w-kl-gruen-150060gs75000-29279201.pdf?src-supplier=Conrad; ComponentLink2Description: https://datasheet.ciiva.com/29279/759427-da-01-en-chipled-0603-w-kl-gruen-150060gs75000-29279201.pdf?src-supplier=Conrad; ComponentLink3URL: https://datasheet.ciiva.com/29562/150060gs75000-29562869.pdf?src-supplier=Digi-Key; ComponentLink3Description: https://datasheet.ciiva.com/29562/150060gs75000-29562869.pdf?src-supplier=Digi-Key; ComponentLink4URL: https://datasheet.ciiva.com/29562/150060gs75000-29562870.pdf?src-supplier=Digi-Key; ComponentLink4Description: https://datasheet.ciiva.com/29562/150060gs75000-29562870.pdf?src-supplier=Digi-Key
R126-R149 R158-R167 R178-R180 = RC0603FR-13180RL: YAGEO 0603 180 ohm; Manufacturer_Name: KEMET; Manufacturer_Part_Number: RC0603JR-070RL; Geometry.Height: 0.55mm; Mouser Part Number: 603-RC0603JR-070RL; Mouser Price/Stock: https://www.mouser.co.uk/ProductDetail/YAGEO/RC0603JR-070RL?qs=2cAdsCoAWRGWyPcuXgGiXQ%3D%3D; Datasheet Link: https://datasheet.datasheetarchive.com/originals/distributors/Datasheets_SAMA/902f9e387b938f871d31120f5fc1d65e.pdf
R150-R157 R168-R177 R181-R194 = RC0603JR-070RL: as R1 on sheet Digital_Input; Mouser Part Number: 603-RC0603JR-070RL; Mouser Price/Stock: https://www.mouser.co.uk/ProductDetail/YAGEO/RC0603JR-070RL?qs=2cAdsCoAWRGWyPcuXgGiXQ%3D%3D; Manufacturer_Part_Number: RC0603JR-070RL; Datasheet Link: https://datasheet.datasheetarchive.com/originals/distributors/Datasheets_SAMA/902f9e387b938f871d31120f5fc1d65e.pdf
U2 = SN74ABT240ADBR: Octal Buffers/Drivers With 3-State Outputs; Manufacturer_Name: Texas Instruments; Geometry.Height: 2mm; Mouser Part Number: 595-SN74ABT240ADBR; Mouser Price/Stock: https://www.mouser.co.uk/ProductDetail/Texas-Instruments/SN74ABT240ADBR?qs=JHHQeKcAU3Dt82k%252BVyiYdw%3D%3D; Manufacturer_Part_Number: SN74ABT240ADBR; Datasheet Link: http://www.ti.com/lit/gpn/sn74abt240a
U3 U4 = SN74AC04PWR: Hex Inverters; Manufacturer_Name: Texas Instruments; Geometry.Height: 1.2mm; Mouser Part Number: 595-SN74AC04PWR; Mouser Price/Stock: https://www.mouser.co.uk/ProductDetail/Texas-Instruments/SN74AC04PWR?qs=RZS%252BpEsUn7pRvPNqsga4SA%3D%3D; Manufacturer_Part_Number: SN74AC04PWR; Datasheet Link: http://www.ti.com/lit/gpn/sn74ac04

## Nets that join several sheets
+3.3: Digital_Input_CPU (H3.3 TP1.1), Digital_Input_LED_Monitor (R159.2)
+5: Digital_Input (10 pins), Digital_Input_CPU (12 pins), Digital_Input_LED_Monitor (39 pins)
GND: Digital_Input (22 pins), Digital_Input_CPU (12 pins), Digital_Input_LED_Monitor (7 pins)
75ALS194EN: Digital_Input_CPU (R107.2), Digital_Input_LED_Monitor (R155.2)
CPU_CS: Digital_Input_CPU (R80.2 R109.2), Digital_Input_LED_Monitor (R153.2)
CPU_D0: Digital_Input_CPU (R69.1 R85.1), Digital_Input_LED_Monitor (U2.2)
CPU_D1: Digital_Input_CPU (R71.1 R87.1), Digital_Input_LED_Monitor (U2.4)
CPU_D2: Digital_Input_CPU (R74.1 R89.1), Digital_Input_LED_Monitor (U2.6)
CPU_D3: Digital_Input_CPU (R77.1 R91.1), Digital_Input_LED_Monitor (U2.8)
CPU_D4: Digital_Input_CPU (R79.1 R93.1), Digital_Input_LED_Monitor (U2.11)
CPU_D5: Digital_Input_CPU (R81.1 R95.1), Digital_Input_LED_Monitor (U2.13)
CPU_D6: Digital_Input_CPU (R83.1 R97.1), Digital_Input_LED_Monitor (U2.15)
CPU_D7: Digital_Input_CPU (R84.1 R99.1), Digital_Input_LED_Monitor (U2.17)
CPU_nInt: Digital_Input_CPU (R75.2 R111.2), Digital_Input_LED_Monitor (R152.2)
CPU_Reset: Digital_Input_CPU (R82.2 R88.2), Digital_Input_LED_Monitor (R154.2)
CPU_RnW: Digital_Input_CPU (R78.2 R110.2), Digital_Input_LED_Monitor (R150.2 R194.2)
Digital_Input_0: Digital_Input (R14.1), Digital_Input_CPU (R90.2), Digital_Input_LED_Monitor (R169.2)
Digital_Input_1: Digital_Input (R38.1), Digital_Input_CPU (R92.2), Digital_Input_LED_Monitor (R171.2)
Digital_Input_2: Digital_Input (R48.1), Digital_Input_CPU (R94.2), Digital_Input_LED_Monitor (R173.2)
Digital_Input_3: Digital_Input (R60.1), Digital_Input_CPU (R96.2), Digital_Input_LED_Monitor (R175.2)
Digital_Input_4: Digital_Input (R13.1), Digital_Input_CPU (R98.2), Digital_Input_LED_Monitor (R177.2)
Digital_Input_5: Digital_Input (R37.1), Digital_Input_CPU (R100.2), Digital_Input_LED_Monitor (R182.2)
Digital_Input_6: Digital_Input (R47.1), Digital_Input_CPU (R101.2), Digital_Input_LED_Monitor (R190.2)
Digital_Input_7: Digital_Input (R59.1), Digital_Input_CPU (R103.2), Digital_Input_LED_Monitor (R192.2)
Digital_Input_Source_0: Digital_Input (R16.2), Digital_Input_CPU (R112.2), Digital_Input_LED_Monitor (LED16.1)
Digital_Input_Source_1: Digital_Input (R40.2), Digital_Input_CPU (R113.2), Digital_Input_LED_Monitor (LED15.1)
Digital_Input_Source_2: Digital_Input (R50.2), Digital_Input_CPU (R114.2), Digital_Input_LED_Monitor (LED14.1)
Digital_Input_Source_3: Digital_Input (R62.2), Digital_Input_CPU (R116.2), Digital_Input_LED_Monitor (LED13.1)
Digital_Input_Source_4: Digital_Input (R15.2), Digital_Input_CPU (R118.2), Digital_Input_LED_Monitor (LED12.1)
Digital_Input_Source_5: Digital_Input (R39.2), Digital_Input_CPU (R120.2), Digital_Input_LED_Monitor (LED11.1)
Digital_Input_Source_6: Digital_Input (R49.2), Digital_Input_CPU (R122.2), Digital_Input_LED_Monitor (LED10.1)
Digital_Input_Source_7: Digital_Input (R61.2), Digital_Input_CPU (R123.2), Digital_Input_LED_Monitor (LED9.1)
RCLK: Digital_Input_CPU (R104.1 R117.1), Digital_Input_LED_Monitor (R186.2)
Ser_Data_0: Digital_Input_CPU (R105.2 R119.1), Digital_Input_LED_Monitor (R188.2)
SR_CLR: Digital_Input_CPU (R106.1 R124.1), Digital_Input_LED_Monitor (R156.2)
SR_OE: Digital_Input_CPU (R108.1 R121.1), Digital_Input_LED_Monitor (R157.2)
SRCLK: Digital_Input_CPU (R102.1 R115.1), Digital_Input_LED_Monitor (R184.2)